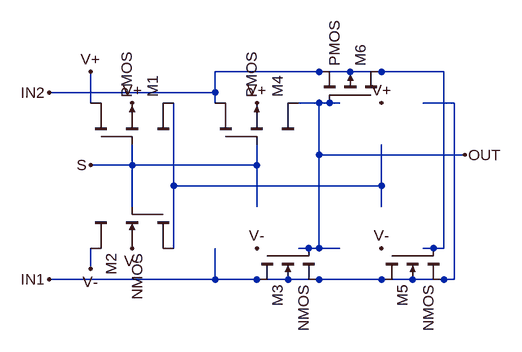
[diagram p0: schematic SPDTlvs.asc]
SPDTlvs.asc, the LTspice schematic file:
Version 4
SHEET 1 880 680
WIRE 480 16 128 16
WIRE 128 48 128 16
WIRE 128 48 -128 48
WIRE -64 64 -64 16
WIRE 128 64 128 48
WIRE 288 64 256 64
WIRE 320 64 288 64
WIRE 496 64 448 64
WIRE 288 144 288 64
WIRE 512 144 288 144
WIRE 0 160 0 128
WIRE 0 160 -64 160
WIRE 192 160 192 128
WIRE 192 160 0 160
WIRE 64 192 64 64
WIRE 384 192 384 128
WIRE 384 192 64 192
WIRE 0 224 0 160
WIRE 192 224 192 160
WIRE 384 224 384 192
WIRE 64 288 64 192
WIRE 288 288 288 144
WIRE 288 288 256 288
WIRE 320 288 288 288
WIRE 480 288 480 16
WIRE 480 288 448 288
WIRE -64 320 -64 288
WIRE 128 336 128 288
WIRE 128 336 -128 336
WIRE 496 336 496 64
WIRE 496 336 128 336
FLAG -128 336 IN1
FLAG -128 48 IN2
FLAG -64 160 S
FLAG 384 64 V+
FLAG 192 64 V+
FLAG 0 64 V+
FLAG 384 288 V-
FLAG 192 288 V-
FLAG 0 288 V-
FLAG -64 320 V-
FLAG -64 16 V+
FLAG 512 144 OUT
SYMBOL cktsym\\pmos4 0 64 M270
SYMATTR InstName M1
SYMATTR Value2 l=.9u w=6u
SYMBOL cktsym\\nmos4 0 288 M90
SYMATTR InstName M2
SYMATTR Value2 l=.9u w=3u
SYMBOL cktsym\\nmos4 192 288 M90
SYMATTR InstName M3
SYMATTR Value2 l=.9u w=3u
SYMBOL cktsym\\pmos4 192 64 M270
SYMATTR InstName M4
SYMATTR Value2 l=.9u w=6u
SYMBOL cktsym\\nmos4 384 288 M90
SYMATTR InstName M5
SYMATTR Value2 l=.9u w=3u
SYMBOL cktsym\\pmos4 384 64 M270
SYMATTR InstName M6
SYMATTR Value2 l=.9u w=6u

The netlist it stands for:
* SPDTlvs.asc
M1 V+ S N001 V+ PMOS l=.9u w=6u
M2 V- S N001 V- NMOS l=.9u w=3u
M3 IN1 OUT IN1 IN1 NMOS l=.9u w=3u
M4 IN2 S OUT V+ PMOS l=.9u w=6u
M5 IN1 IN2 IN1 IN1 NMOS l=.9u w=3u
M6 IN2 OUT IN2 IN2 PMOS l=.9u w=6u
.model NMOS NMOS
.model PMOS PMOS
.lib standard.mos
.backanno
.end